# Altium schematic sheet COMS0005_Comms_Test_Board.SchDoc: BLUEsat Communications Test Board
size A3; DrawnBy: Thomas Fisk; Engineer: T. FISK; Organization: BLUEsat Project; Address1: Room 419; Address2: School of EE&T; Address3: UNSW, NSW 2052; Address4: Australia; DocumentNumber: COMS0005; SheetNumber: 1; SheetTotal: 1; Description: Test board for communications subsystem.; Version: 1.0
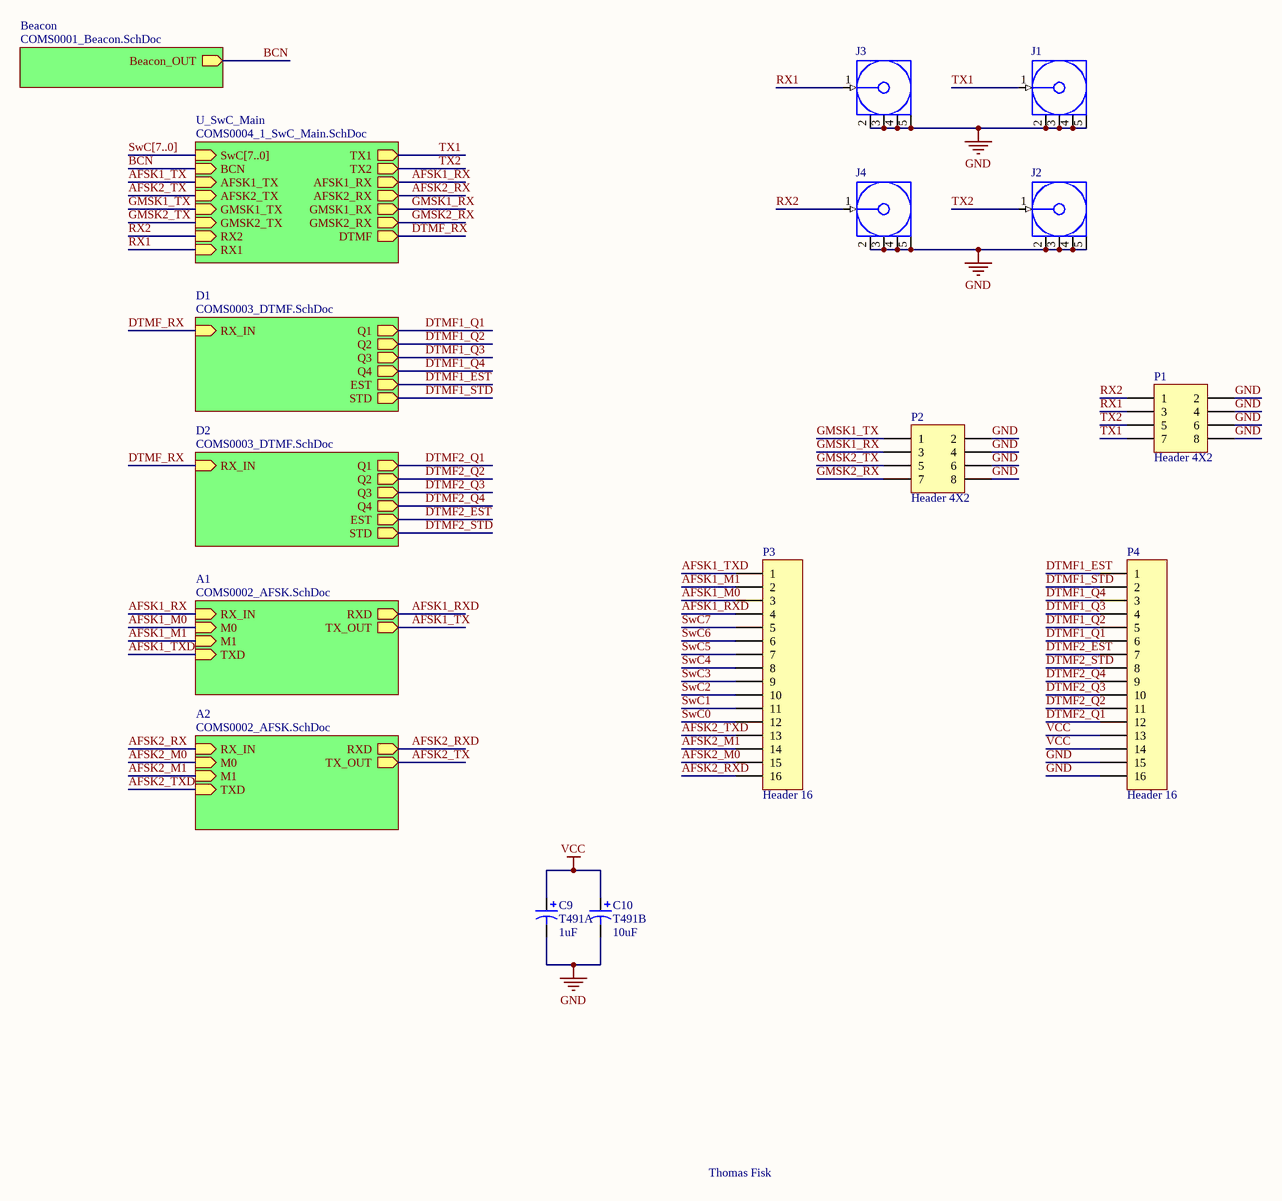
[diagram p0: COMS0005_Comms_Test_Board.SchDoc]

## Parts
C9  T491A  value 1uF  [A]
C10  T491B  value 10uF  [B]
J1  TX1  [SMB_V-RJ45]  (value not drawn)
J2  TX2  [SMB_V-RJ45]  (value not drawn)
J3  RX2  [SMB_V-RJ45]  (value not drawn)
J4  RX1  [SMB_V-RJ45]  (value not drawn)
P1  Header 4X2  [HDR2X4]
P2  Header 4X2  [HDR2X4]
P3  Header 16  [HDR1X16]
P4  Header 16  [HDR1X16]

## Sub-sheets
A1 = COMS0002_AFSK.SchDoc: RX_IN (in), M0 (in), M1 (in), TXD (in), RXD (out), TX_OUT (out)
A2 = COMS0002_AFSK.SchDoc: RX_IN (in), M0 (in), M1 (in), TXD (in), RXD (out), TX_OUT (out)
Beacon = COMS0001_Beacon.SchDoc: Beacon_OUT (out)
D1 = COMS0003_DTMF.SchDoc: RX_IN (in), STD (out), EST (out), Q1 (out), Q2 (out), Q3 (out), Q4 (out)
D2 = COMS0003_DTMF.SchDoc: RX_IN (in), STD (out), EST (out), Q1 (out), Q2 (out), Q3 (out), Q4 (out)
U_SwC_Main = COMS0004_1_SwC_Main.SchDoc: SwC[7..0] (in), BCN (in), AFSK1_TX (in), AFSK2_TX (in), GMSK1_TX (in), GMSK2_TX (in), TX1 (out), TX2 (out), RX2 (in), RX1 (in), AFSK1_RX (out), AFSK2_RX (out), GMSK1_RX (out), GMSK2_RX (out), DTMF (out)

## Nets
GND: C9.2 C10.2 J1.2(GND) J1.3(GND) J1.4(GND) J1.5(GND) J2.2(GND) J2.3(GND) J2.4(GND) J2.5(GND) J3.2(GND) J3.3(GND) J3.4(GND) J3.5(GND) J4.2(GND) J4.3(GND) J4.4(GND) J4.5(GND) P1.2 P1.4 P1.6 P1.8 P2.2 P2.4 P2.6 P2.8 P4.15 P4.16
VCC: C9.1 C10.1 P4.13 P4.14
AFSK1_M0: P3.3 ; sheet A1/M0
AFSK1_M1: P3.2 ; sheet A1/M1
AFSK1_RX: sheet A1/RX_IN, sheet U_SwC_Main/AFSK1_RX
AFSK1_RXD: P3.4 ; sheet A1/RXD
AFSK1_TX: sheet A1/TX_OUT, sheet U_SwC_Main/AFSK1_TX
AFSK1_TXD: P3.1 ; sheet A1/TXD
AFSK2_M0: P3.15 ; sheet A2/M0
AFSK2_M1: P3.14 ; sheet A2/M1
AFSK2_RX: sheet A2/RX_IN, sheet U_SwC_Main/AFSK2_RX
AFSK2_RXD: P3.16 ; sheet A2/RXD
AFSK2_TX: sheet A2/TX_OUT, sheet U_SwC_Main/AFSK2_TX
AFSK2_TXD: P3.13 ; sheet A2/TXD
BCN: sheet Beacon/Beacon_OUT, sheet U_SwC_Main/BCN
DTMF1_EST: P4.1 ; sheet D1/EST
DTMF1_Q1: P4.6 ; sheet D1/Q1
DTMF1_Q2: P4.5 ; sheet D1/Q2
DTMF1_Q3: P4.4 ; sheet D1/Q3
DTMF1_Q4: P4.3 ; sheet D1/Q4
DTMF1_STD: P4.2 ; sheet D1/STD
DTMF2_EST: P4.7 ; sheet D2/EST
DTMF2_Q1: P4.12 ; sheet D2/Q1
DTMF2_Q2: P4.11 ; sheet D2/Q2
DTMF2_Q3: P4.10 ; sheet D2/Q3
DTMF2_Q4: P4.9 ; sheet D2/Q4
DTMF2_STD: P4.8 ; sheet D2/STD
DTMF_RX: sheet D1/RX_IN, sheet D2/RX_IN, sheet U_SwC_Main/DTMF
GMSK1_RX: P2.3 ; sheet U_SwC_Main/GMSK1_RX
GMSK1_TX: P2.1 ; sheet U_SwC_Main/GMSK1_TX
GMSK2_RX: P2.7 ; sheet U_SwC_Main/GMSK2_RX
GMSK2_TX: P2.5 ; sheet U_SwC_Main/GMSK2_TX
RX1: J3.1(Signal) P1.3 ; sheet U_SwC_Main/RX1
RX2: J4.1(Signal) P1.1 ; sheet U_SwC_Main/RX2
SwC0: P3.12
SwC1: P3.11
SwC2: P3.10
SwC3: P3.9
SwC4: P3.8
SwC5: P3.7
SwC6: P3.6
SwC7: P3.5
TX1: J1.1(Signal) P1.7 ; sheet U_SwC_Main/TX1
TX2: J2.1(Signal) P1.5 ; sheet U_SwC_Main/TX2

## Buses and harness runs
bus SwC[7..0] = sheet U_SwC_Main/SwC[7..0]

## Notes on the sheet
- Thomas Fisk
- Title
- Description:
- Size:
- Author:
- Date:
- A3
- Time:
- Version
- Sheet:
- Drawing No.:
- of
- File:

## Library data of the parts
C9 = T491A: Solid Tantalum Chip Capacitor, Standard T491 Series - Industrial Grade; Published: 17-Jul-2002; LatestRevisionDate: 19-Mar-2004; LatestRevisionNote: Silkscreen dimensions re-sized.; DatasheetDocument: Mar-2001; PackageDocument: Mar-2001; PackageReference: A; Publisher: Altium Limited; Code_JEITA: 3216-18; ComponentLink1Description: Manufacturer Link; ComponentLink1URL: http://www.kemet.com/; ComponentLink2Description: Datasheet; ComponentLink2URL: http://www.kemet.com/kemet/web/homepage/kechome.nsf/vapubfilesname/F3102TA.pdf/$file/F3102TA.pdf
C10 = T491B: Solid Tantalum Chip Capacitor, Standard T491 Series - Industrial Grade; Published: 17-Jul-2002; LatestRevisionDate: 19-Mar-2004; LatestRevisionNote: Silkscreen dimensions re-sized.; DatasheetDocument: Mar-2001; PackageDocument: Mar-2001; PackageReference: B; Publisher: Altium Limited; Code_JEITA: 3528-21; ComponentLink1Description: Manufacturer Link; ComponentLink1URL: http://www.kemet.com/; ComponentLink2Description: Datasheet; ComponentLink2URL: http://www.kemet.com/kemet/web/homepage/kechome.nsf/vapubfilesname/F3102TA.pdf/$file/F3102TA.pdf
J1-J4 = COAX-F: RF Coaxial PCB Connector, MCX; Thru-Hole, Right-Angle Mount Socket, Blunt Post Terminal, 50 Ohm Impedance; pin to pad: 3>2 4>2 5>2; PCB_Layout: Complies with manufacturer's recommendation.; DrillSize: Corresponds to nominal value.; Published: 15-Jul-2004; LatestRevisionDate: 15-Jul-2004; LatestRevisionNote: Component Replaced.; DatasheetDocument: 30-May-2003; PackageDocument: 04-Jul-1999; PackageReference: 919-119J-51AX; Publisher: Altium Limited; ComponentLink1Description: Manufacturer Link; ComponentLink1URL: http://www.amphenolrf.com/
P1 P2 = Header 4X2: Header, 4-Pin, Dual row; LatestRevisionDate: 17-Jul-2002; LatestRevisionNote: Re-released for DXP Platform.; Publisher: Altium Limited
P3 P4 = Header 16: Header, 16-Pin; LatestRevisionDate: 17-Jul-2002; LatestRevisionNote: Re-released for DXP Platform.; Publisher: Altium Limited